# Altium schematic sheet Flyback Converter.SchDoc: Flyback Converter
size A4; CompanyName: -; DrawnBy: Naldi, López; Revision: 1; SheetNumber: 2; SheetTotal: 2; Number: 25
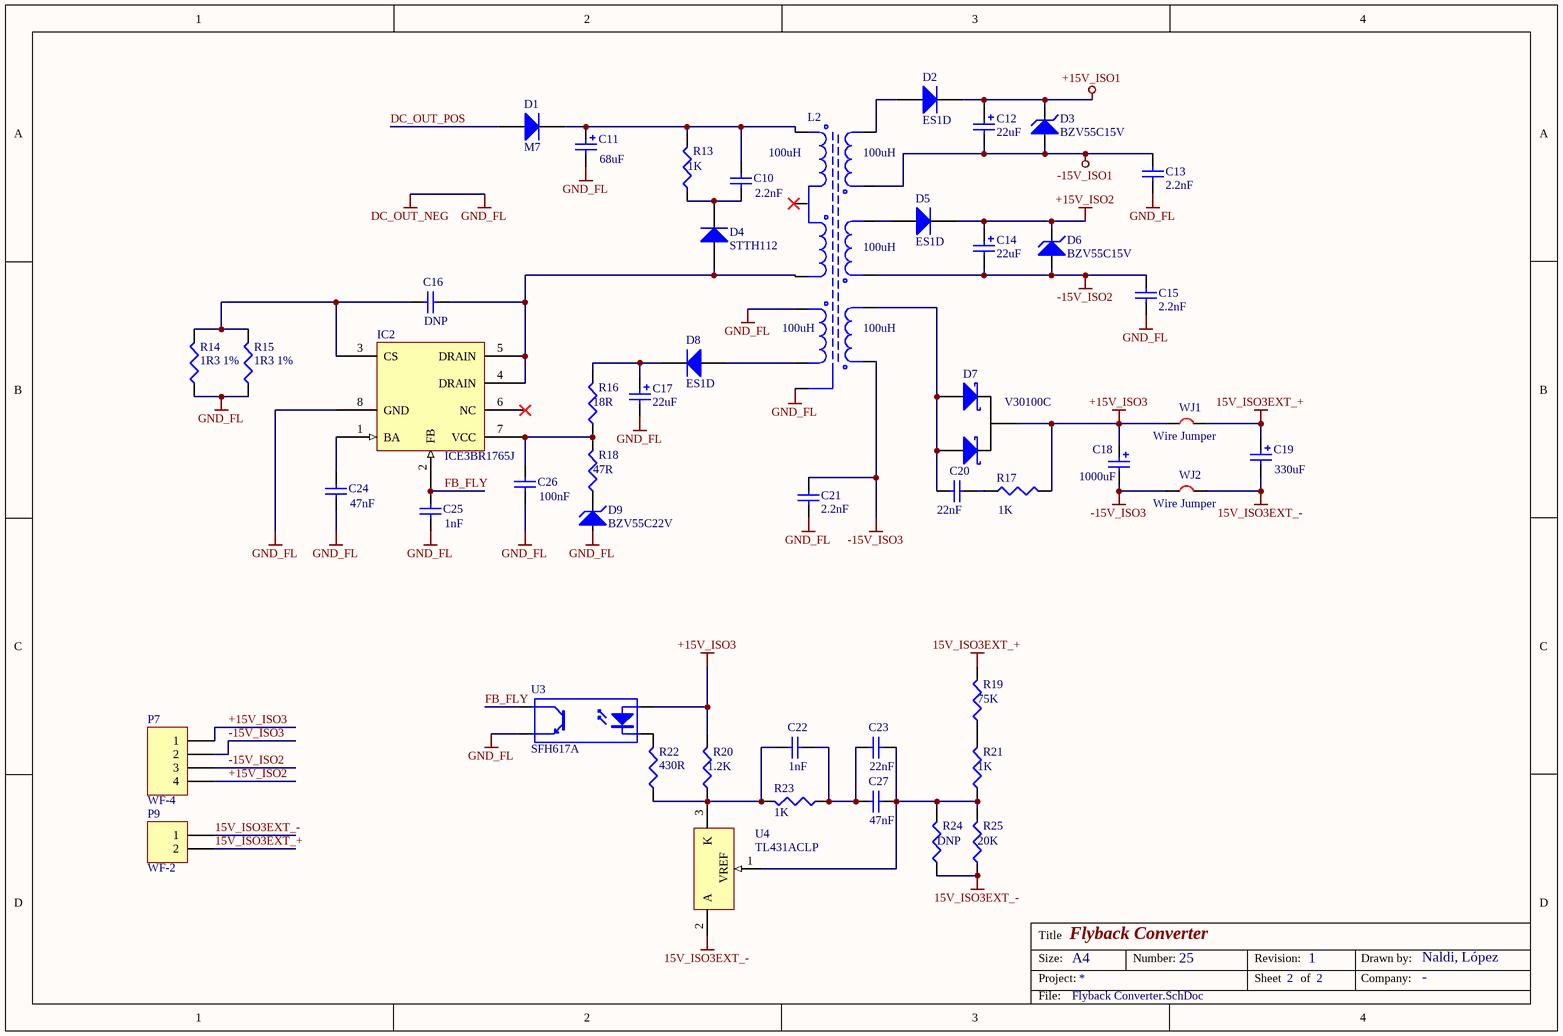
[diagram p0: Flyback Converter.SchDoc]

## Parts
C10  value 2.2nF  [CAPC3216X18N 1206]  (hidden comment: TDK C3216C0G2J222J115AA)
C11  value 68uF  [Radial, pitch: 7.5mm diam:18mm]  (hidden comment: RUBYCON 400BXC68MEFC18X25)
C12  value 22uF  [Radial, Pitch: 2mm Diam: 5mm]  (hidden comment: EPCOS B41827A6226M000)
C13  value 2.2nF  [SAFETY Y1 type]  (hidden comment: TDK CD12-E2GA222MYNS)
C14  value 22uF  [Radial, Pitch: 2mm Diam: 5mm]  (hidden comment: EPCOS B41827A6226M000)
C15  value 2.2nF  [Chip2PinSM127P600-8N_safety]  (hidden comment: MURATA GA355QR7GF222KW01L)
C16  value DNP  [CAPC3216X18N 1206]  (hidden comment: EPCOS B37871K5221J60)
C17  value 22uF  [Radial, Pitch: 2mm Diam: 5mm]  (hidden comment: EPCOS B41827A6226M000)
C18  value 1000uF  [Rad 12.5mm  pitch: 5mm]  (hidden comment: EPCOS B41856A5108M000)
C19  value 330uF  [Rad 10mm  pitch: 5mm]  (hidden comment: EPCOS B41856A5337M008)
C20  value 22nF  [CAPC3216X18N 1206]  (hidden comment: EPCOS B37872K5223K60)
C21  value 2.2nF  [SAFETY Y1 type]  (hidden comment: TDK CD12-E2GA222MYNS)
C22  value 1nF  [Chip2PinSM127P600-8N]  (hidden comment: EPCOS B37940K51102J60)
C23  value 22nF  [CAPC3216X18N 1206]  (hidden comment: EPCOS B37872K5223K60)
C24  value 47nF  [CAPC3216X18N 1206]  (hidden comment: EPCOS CL31B473KBCNNNC)
C25  value 1nF  [MKT Pitch: 5mm 2.5 × 7.3 mm]  (hidden comment: EPCOS B32529C0102K000)
C26  value 100nF  [Chip2PinSM127P600-8N]  (hidden comment: EPCOS C2012X7R1H104K)
C27  value 47nF  [CAPC3216X18N 1206]  (hidden comment: EPCOS CL31B473KBCNNNC)
D1  M7  [DIOM4326X26N - SMA]
D2  ES1D  [DIOM4326X26N - SMA]
D3  BZV55C15V  [DIOMELF3515N]
D4  STTH112  [DIOM4336X26N - SMB]
D5  ES1D  [DIOM4326X26N - SMA]
D6  BZV55C15V  [DIOMELF3515N]
D7  V30100C  [TO-220 Horiz. Heatsink]
D8  ES1D  [DIOM4326X26N - SMA]
D9  BZV55C22V  [DIOMELF3515N]
IC2  ICE3BR1765J  [PDIP8]
L2  Value_P1: 100uH  [CORE_E_20/10/6_14pin]  (hidden comment: 2 Primary, 3 Secondary, Shield)
P7  WF-4  [HDR1X4]
P9  WF-2  [HDR1X2]
R13  value 1K  [Chip2PinSM127P600-8N 2512]  (hidden comment: Resistor SMD 2512)
R14  value 1R3 1%  [RESC3116X07N - 1206]  (hidden comment: Resistor SMD 1206)
R15  value 1R3 1%  [RESC3116X07N - 1206]  (hidden comment: Resistor SMD 1206)
R16  value 18R  [Chip2PinSM127P600-8N - 0805]  (hidden comment: Resistor SMD 0805)
R17  value 1K  [RESC3116X07N - 1206]  (hidden comment: Resistor SMD 1206)
R18  value 47R  [Chip2PinSM127P600-8N - 0805]  (hidden comment: Resistor SMD 0805)
R19  value 75K  [AXIAL-0.3]  (hidden comment: Resistor Through-hole)
R20  value 1.2K  [Chip2PinSM127P600-8N - 0805]  (hidden comment: Resistor SMD 0805)
R21  value 1K  [Chip2PinSM127P600-8N - 0805]  (hidden comment: Resistor SMD 0805)
R22  value 430R  [Chip2PinSM127P600-8N - 0805]  (hidden comment: Resistor SMD 0805)
R23  value 1K  [Chip2PinSM127P600-8N - 0805]  (hidden comment: Resistor SMD 0805)
R24  value DNP  [Chip2PinSM127P600-8N - 0805]  (hidden comment: Resistor SMD 0805)
R25  value 20K  [Chip2PinSM127P600-8N - 0805]  (hidden comment: Resistor SMD 0805)
U3  SFH617A  [DIP4]
U4  TL431ACLP  [LP03]
WJ1  Wire Jumper  (net tie, no BOM)
WJ2  Wire Jumper  (net tie, no BOM)

## Nets
15V_ISO3EXT_+: C19.1 P9.2 R19.2 WJ1.1
15V_ISO3EXT_-: C19.2 P9.1 R24.1 R25.1 U4.2(A) WJ2.1
+15V_ISO1: C12.1 D2.1(K) D3.2(K)
+15V_ISO2: C14.1 D5.1(K) D6.2(K) P7.4
+15V_ISO3: C18.1 D7.2(K12) P7.1 R17.2 R20.2 U3.1(A) WJ1.0
-15V_ISO1: C12.2 C13.2 D3.1(A) L2.9
-15V_ISO2: C14.2 C15.1 D6.1(A) L2.11 P7.3
-15V_ISO3: C18.2 C21.2 L2.13 P7.2 WJ2.0
DC_OUT_NEG: C11.2 C13.1 C15.2 C17.2 C21.1 C24.1 C25.1 C26.1 D9.1(A) IC2.8(GND) L2.1 L2.5 R14.1 R15.1 U3.3(E)  [also labelled GND_FL]
DC_OUT_POS: D1.2(A)
FB_FLY: C25.2 IC2.2(FB) U3.4(C)
NetC10_1: C10.1 D4.1(K) R13.1
NetC10_2: C10.2 C11.1 D1.1(K) L2.2 R13.2
NetC16_1: C16.1 IC2.3(CS) R14.2 R15.2
NetC16_2: C16.2 D4.2(A) IC2.4(DRAIN) IC2.5(DRAIN) L2.4
NetC17_1: C17.1 D8.1(K) R16.2
NetC20_1: C20.1 D7.1(A1) D7.3(A2) L2.12
NetC20_2: C20.2 R17.1
NetC22_1: C22.1 R20.1 R22.1 R23.2 U4.3(K)
NetC22_2: C22.2 C23.1 C27.1 R23.1
NetC23_2: C23.2 C27.2 R21.1 R24.2 R25.2 U4.1(VREF)
NetC24_2: C24.2 IC2.1(BA)
NetC26_2: C26.2 IC2.7(VCC) R16.1 R18.2
NetD2_2: D2.2(A) L2.8
NetD5_2: D5.2(A) L2.10
NetD8_2: D8.2(A) L2.6
NetD9_2: D9.2(K) R18.1
NetR19_1: R19.1 R21.2
NetR22_2: R22.2 U3.2(K)

Not connected (* = marked no-connect by the designer): IC2 6(NC)*; L2 3*

## Notes on the sheet
- Title
- Size:
- Project:
- A4
- Number:
- Revision:
- Sheet
- of
- Drawn by:
- Company:
- File:

## Library data of the parts
C10 = TDK C3216C0G2J222J115AA: Ceramic Multilayer 2.2nF 630Vdc COG; Published: 8-Jun-2000; LatestRevisionDate: 17-Jul-2002; LatestRevisionNote: Re-released for DXP Platform.; PackageReference: RAD-0.3; Publisher: Altium Limited; PackageDescription: Radial Cap, Thru-Hole; 2 Leads; 0.3 in Pin Spacing
C11 = RUBYCON 400BXC68MEFC18X25: MINIATURE ALUMINUM ELECTROLYTIC 68uF 400V 105ºC; Published: 8-Jun-2000; LatestRevisionDate: 17-Jul-2002; LatestRevisionNote: Re-released for DXP Platform.; PackageReference: RB7.6-15; Publisher: Altium Limited; PackageDescription: Polarized Capacitor (Radial); 2 Leads
C12 C14 C17 = EPCOS B41827A6226M000: ALUMINUM ELECTROLYTIC 22UFX50V; Published: 8-Jun-2000; LatestRevisionDate: 17-Jul-2002; LatestRevisionNote: Re-released for DXP Platform.; PackageReference: RB7.6-15; Publisher: Altium Limited; PackageDescription: Polarized Capacitor (Radial); 2 Leads
C13 C21 = TDK CD12-E2GA222MYNS: Safety Standard Certified Ceramic Y1 2.2nF 250Vac; Published: 8-Jun-2000; LatestRevisionDate: 17-Jul-2002; LatestRevisionNote: Re-released for DXP Platform.; PackageReference: RAD-0.3; Publisher: Altium Limited; PackageDescription: Radial Cap, Thru-Hole; 2 Leads; 0.3 in Pin Spacing
C15 = MURATA GA355QR7GF222KW01L: Safety Standard Certified Ceramic Y2 2.2nF 250Vac; Published: 8-Jun-2000; LatestRevisionDate: 17-Jul-2002; LatestRevisionNote: Re-released for DXP Platform.; PackageReference: RAD-0.3; Publisher: Altium Limited; PackageDescription: Radial Cap, Thru-Hole; 2 Leads; 0.3 in Pin Spacing
C16 = EPCOS B37871K5221J60: Ceramic Multilayer  50Vdc C0G; Published: 8-Jun-2000; LatestRevisionDate: 17-Jul-2002; LatestRevisionNote: Re-released for DXP Platform.; PackageReference: RAD-0.3; Publisher: Altium Limited; PackageDescription: Radial Cap, Thru-Hole; 2 Leads; 0.3 in Pin Spacing
C18 = EPCOS B41856A5108M000: ALuminum Electrolytic Low Impedance 105 °C 1000uF x 25V; Published: 8-Jun-2000; LatestRevisionDate: 17-Jul-2002; LatestRevisionNote: Re-released for DXP Platform.; PackageReference: RB7.6-15; Publisher: Altium Limited; PackageDescription: Polarized Capacitor (Radial); 2 Leads
C19 = EPCOS B41856A5337M008: ALuminum Electrolytic Low Impedance 105 °C 330uF x 25V; Published: 8-Jun-2000; LatestRevisionDate: 17-Jul-2002; LatestRevisionNote: Re-released for DXP Platform.; PackageReference: RB7.6-15; Publisher: Altium Limited; PackageDescription: Polarized Capacitor (Radial); 2 Leads
C20 C23 = EPCOS B37872K5223K60: Ceramic Multilayer 22nF 50Vdc X7R; Published: 8-Jun-2000; LatestRevisionDate: 17-Jul-2002; LatestRevisionNote: Re-released for DXP Platform.; PackageReference: RAD-0.3; Publisher: Altium Limited; PackageDescription: Radial Cap, Thru-Hole; 2 Leads; 0.3 in Pin Spacing
C22 = EPCOS B37940K51102J60: Ceramic Multilayer 1nF 50Vdc COG; Published: 8-Jun-2000; LatestRevisionDate: 17-Jul-2002; LatestRevisionNote: Re-released for DXP Platform.; PackageReference: RAD-0.3; Publisher: Altium Limited; PackageDescription: Radial Cap, Thru-Hole; 2 Leads; 0.3 in Pin Spacing
C24 C27 = EPCOS CL31B473KBCNNNC: Ceramic Multilayer 47nF 50Vdc X7R; Published: 8-Jun-2000; LatestRevisionDate: 17-Jul-2002; LatestRevisionNote: Re-released for DXP Platform.; PackageReference: RAD-0.3; Publisher: Altium Limited; PackageDescription: Radial Cap, Thru-Hole; 2 Leads; 0.3 in Pin Spacing
C25 = EPCOS B32529C0102K000: MKT General purpose 1nF 63Vdc; Published: 8-Jun-2000; LatestRevisionDate: 17-Jul-2002; LatestRevisionNote: Re-released for DXP Platform.; PackageReference: RAD-0.3; Publisher: Altium Limited; PackageDescription: Radial Cap, Thru-Hole; 2 Leads; 0.3 in Pin Spacing
C26 = EPCOS C2012X7R1H104K: Ceramic Multilayer 100nF 50Vdc X7R; Published: 8-Jun-2000; LatestRevisionDate: 17-Jul-2002; LatestRevisionNote: Re-released for DXP Platform.; PackageReference: RAD-0.3; Publisher: Altium Limited; PackageDescription: Radial Cap, Thru-Hole; 2 Leads; 0.3 in Pin Spacing
D1 = M7 SMA: 1A 1000V SMA; Published: 8-Jun-2000; LatestRevisionDate: 17-Jul-2002; LatestRevisionNote: Re-released for DXP Platform.; PackageVersion: Sep-1996; PackageReference: SMC; Publisher: Altium Limited; PackageDescription: DO-214-AB/SMC; 2 C-Bend Leads; Body 7.9 x 5.9 mm, inc. leads (LxW); Code_JEDEC: DO-214-AB
D2 D5 D8 = ES1D: Ultrafast rectifier 1A 200V; Published: 8-Jun-2000; LatestRevisionDate: 17-Jul-2002; LatestRevisionNote: Re-released for DXP Platform.; PackageVersion: Sep-1996; PackageReference: SMC; Publisher: Altium Limited; PackageDescription: DO-214-AB/SMC; 2 C-Bend Leads; Body 7.9 x 5.9 mm, inc. leads (LxW); Code_JEDEC: DO-214-AB
D3 D6 = BZV55C15V: Zener Diode 15V 0.5W; Published: 8-Jun-2000; LatestRevisionDate: 17-Jul-2002; LatestRevisionNote: Re-released for DXP Platform.; PackageReference: DIODE-0.7; Publisher: Altium Limited; PackageDescription: Diode, Thru-Hole; 2 Leads; 0.7 in Pin Spacing
D4 = STTH112: High voltage ultrafast rectifier; Published: 8-Jun-2000; LatestRevisionDate: 17-Jul-2002; LatestRevisionNote: Re-released for DXP Platform.; PackageVersion: Sep-1996; PackageReference: SMC; Publisher: Altium Limited; PackageDescription: DO-214-AB/SMC; 2 C-Bend Leads; Body 7.9 x 5.9 mm, inc. leads (LxW); Code_JEDEC: DO-214-AB
D7 = V30100C: Trench MOS Barrier Schottky Rectifier 2x 15A 100V
D9 = BZV55C22V: Zener Diode 22V 0.5W; Published: 8-Jun-2000; LatestRevisionDate: 17-Jul-2002; LatestRevisionNote: Re-released for DXP Platform.; PackageReference: DIODE-0.7; Publisher: Altium Limited; PackageDescription: Diode, Thru-Hole; 2 Leads; 0.7 in Pin Spacing
IC2 = ICE3BR1765J: Off-Line SMPS Current Mode  Controller with integrated 650V  CoolMOS® and Startup cell  (frequency jitter Mode)
L2 = 2 Primary, 3 Secondary, Shield: Coupled Inductors with Ferrite Core; Code_IEC: 1005; Published: 8-Jun-2000; LatestRevisionDate: 29-May-2009; LatestRevisionNote: IPC-7351 Footprint Added.; PackageReference: 0402-A; Publisher: Altium Limited; PackageDescription: Chip Inductor; Code_JEITA: 0402; Value_P2: 100uH; Value_S1: 100uH; Value_S2: 100uH; Value_S3: 100uH
P7 = Header 4: Header, 4-Pin, 2.54mm pitch; System: Connector; LatestRevisionDate: 17-Jul-2002; LatestRevisionNote: Re-released for DXP Platform.; Publisher: Altium Limited
P9 = Header 2: Header, 2-Pin, 2.54mm pitch; System: Connector; LatestRevisionDate: 17-Jul-2002; LatestRevisionNote: Re-released for DXP Platform.; Publisher: Altium Limited
R13 = Resistor SMD 2512: Resistor SMD 2512 1W; Published: 8-Jun-2000; LatestRevisionDate: 29-May-2009; LatestRevisionNote: IPC-7351 Footprint Added.; PackageReference: J1-0603; Publisher: Altium Limited; PackageDescription: Chip Resistor
R19 = Resistor: Resistor 1/4W 5%; Published: 8-Jun-2000; LatestRevisionDate: 29-May-2009; LatestRevisionNote: IPC-7351 Footprint Added.; PackageReference: J1-0603; Publisher: Altium Limited; PackageDescription: Chip Resistor
U3 = SFH617A: Phototransistor Output, High Reliability,  5300 VRMS, 110 °C Rated; Published: 24-Mar-1999; LatestRevisionDate: 04-Mar-2005; LatestRevisionNote: Sch pins 3 & 4 Swapped.; DatasheetVersion: Nov-2003; PackageReference: DIP-4; Publisher: Altium Limited
U4 = TL431ACLP: Adjustable Precision Shunt Regulator; Published: 15-Apr-2002; LatestRevisionDate: 06-Jun-2005; LatestRevisionNote: Sch pins 1 & 3 swapped; DatasheetVersion: Oct-2000; PackageVersion: Nov-2001; PackageReference: LP03; Publisher: Altium Limited; PackageDescription: TO, Flat Index; 3 In-Line, Axial Leads; Body Dia. 4.8mm; Leads 0.56 x 0.41 mm (max); Code_JEDEC: TO-226-AA; ComponentLink1Description: Manufacturer Link; ComponentLink1URL: http://www.ti.com/; ComponentLink2Description: Datasheet; ComponentLink2URL: http://www-s.ti.com/sc/ds/tl431a.pdf
R14 R15 R17 = Resistor SMD 1206: Published: 8-Jun-2000; LatestRevisionDate: 29-May-2009; LatestRevisionNote: IPC-7351 Footprint Added.; PackageReference: J1-0603; Publisher: Altium Limited; PackageDescription: Chip Resistor
R16 R18 R20-R25 = Resistor SMD 0805: Published: 8-Jun-2000; LatestRevisionDate: 29-May-2009; LatestRevisionNote: IPC-7351 Footprint Added.; PackageReference: J1-0603; Publisher: Altium Limited; PackageDescription: Chip Resistor